# Altium schematic sheet [Acoustics] ADC.SchDoc: Sample Sheet Title
size B; Date: MM/DD/YYYY; Author: Sample Author; Organization: ORGANIZATION; Address1: ADDRESS 1; Address2: ADDRESS 2; Address3: ADDRESS 3; Address4: ADDRESS 4; Revision: -; SheetNumber: 4; SheetTotal: 5; ENG_APP_DATE: --/--/--; DSN_APP_DATE: --/--/--; CHK_APP_DATE: --/--/--
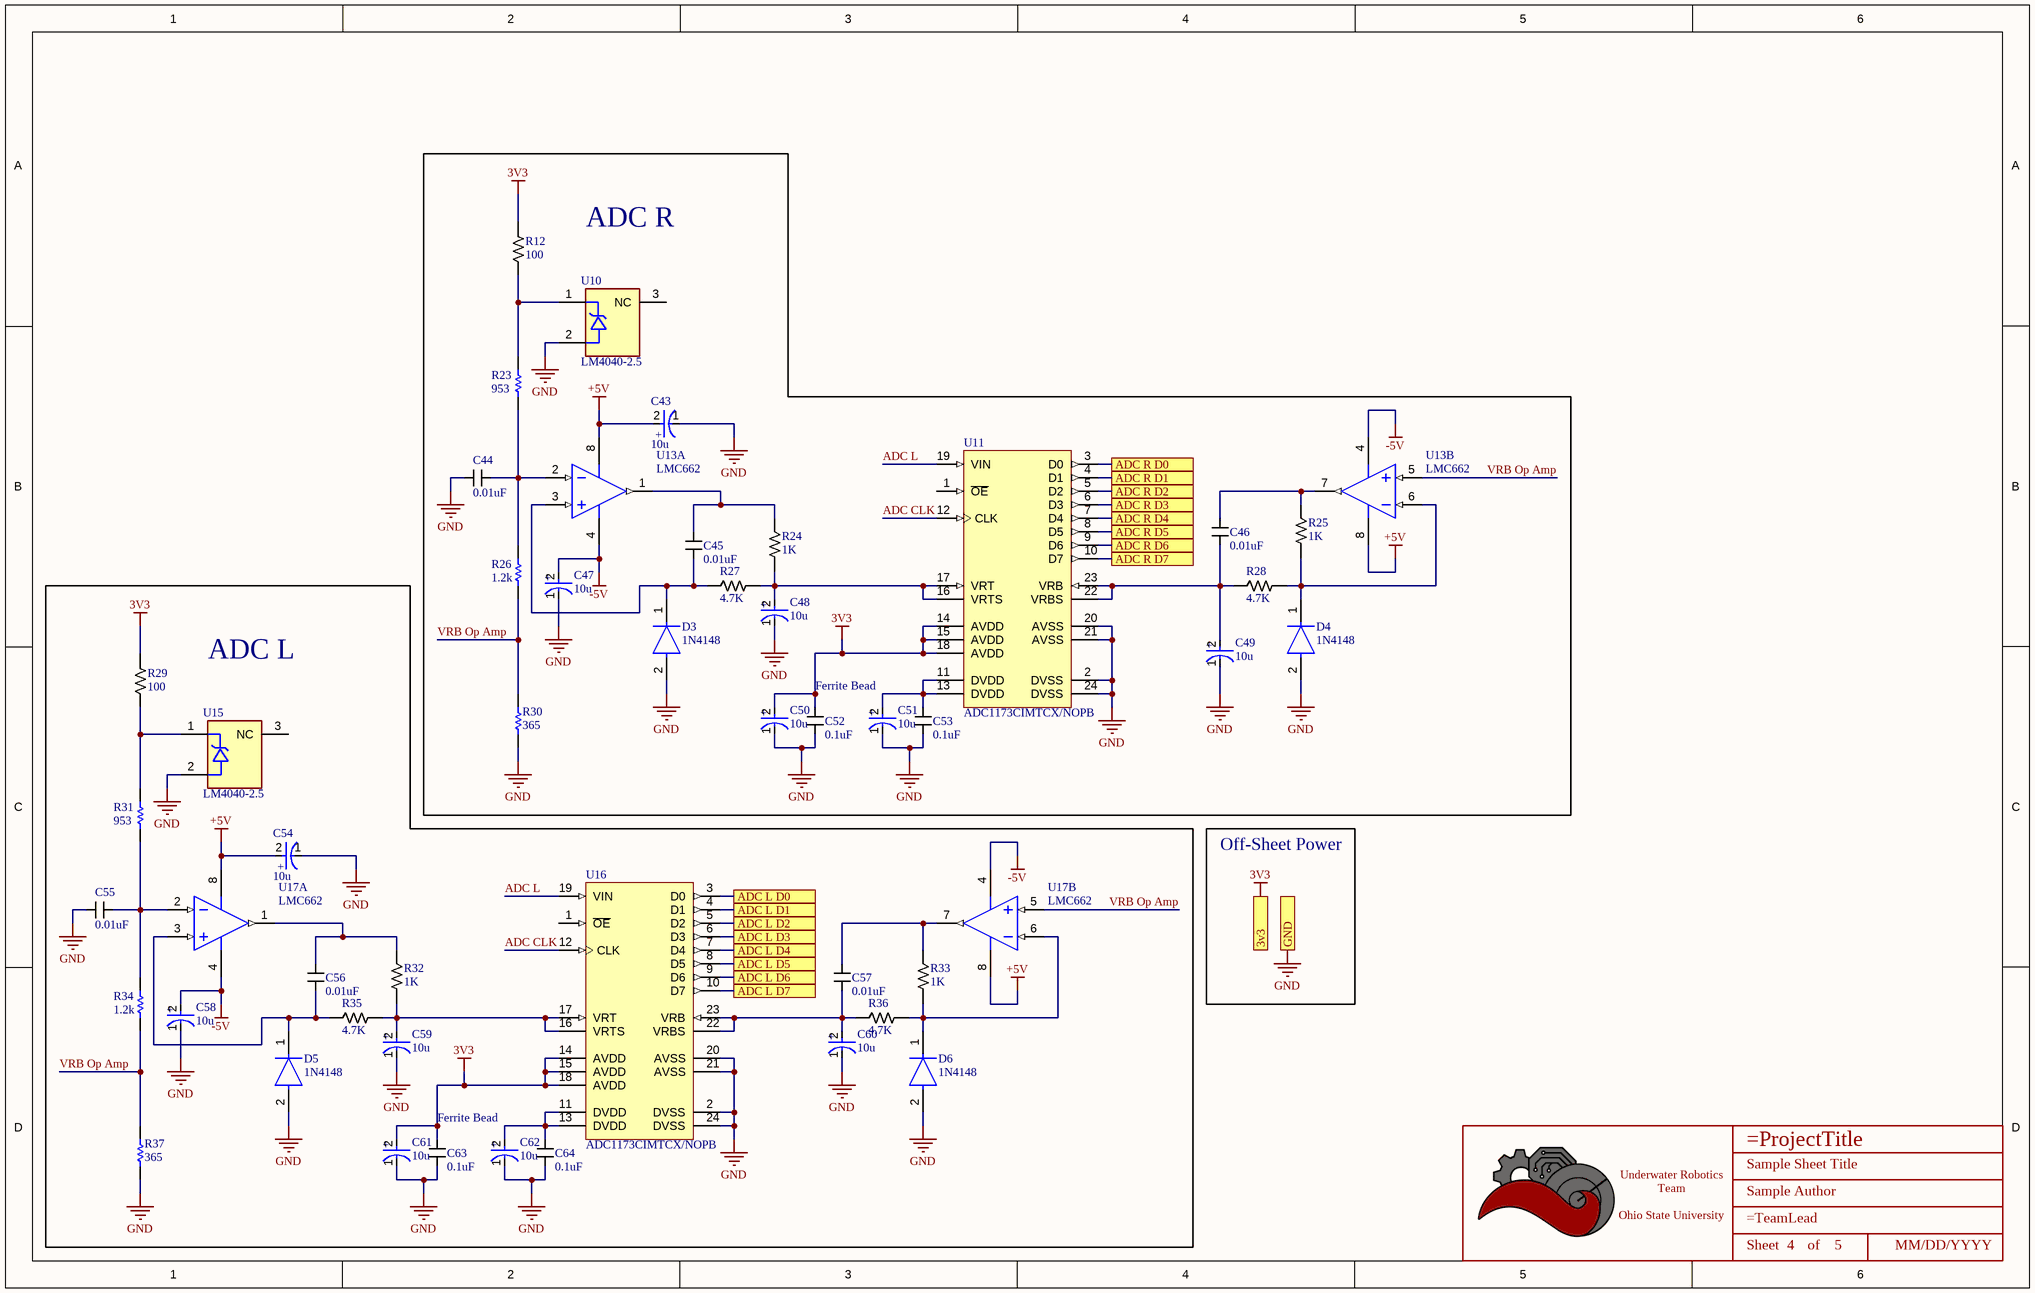
[diagram p0: [Acoustics] ADC.SchDoc]

## Parts
*  Title_Block  [LOGO]  (value not drawn)  (graphical)
C43  10u  [FP-TCJB-MFG]
C44  value 0.01uF  [CAPACITOR_0603]  (hidden comment: CL10B103KB8NNNC)
C45  value 0.01uF  [CAPACITOR_0603]  (hidden comment: CL10B103KB8NNNC)
C46  value 0.01uF  [CAPACITOR_0603]  (hidden comment: CL10B103KB8NNNC)
C47  10u  [FP-TCJB-MFG]
C48  10u  [FP-TCJB-MFG]
C49  10u  [FP-TCJB-MFG]
C50  10u  [FP-TCJB-MFG]
C51  10u  [FP-TCJB-MFG]
C52  value 0.1uF  [CAPACITOR_0603]  (hidden comment: 100nF Ceramic 6.3V)
C53  value 0.1uF  [CAPACITOR_0603]  (hidden comment: 100nF Ceramic 6.3V)
C54  10u  [FP-TCJB-MFG]
C55  value 0.01uF  [CAPACITOR_0603]  (hidden comment: CL10B103KB8NNNC)
C56  value 0.01uF  [CAPACITOR_0603]  (hidden comment: CL10B103KB8NNNC)
C57  value 0.01uF  [CAPACITOR_0603]  (hidden comment: CL10B103KB8NNNC)
C58  10u  [FP-TCJB-MFG]
C59  10u  [FP-TCJB-MFG]
C60  10u  [FP-TCJB-MFG]
C61  10u  [FP-TCJB-MFG]
C62  10u  [FP-TCJB-MFG]
C63  value 0.1uF  [CAPACITOR_0603]  (hidden comment: 100nF Ceramic 6.3V)
C64  value 0.1uF  [CAPACITOR_0603]  (hidden comment: 100nF Ceramic 6.3V)
D3  1N4148  [FP-017AG-MFG]
D4  1N4148  [FP-017AG-MFG]
D5  1N4148  [FP-017AG-MFG]
D6  1N4148  [FP-017AG-MFG]
R12  Value  (Ohms): 100  [RESISTOR_0402]  (hidden comment: 100 Ohm 5% 1/16W)
R23  953  [RESC1005X40X25ML05T05]
R24  Value  (Ohms): 1K  [RESISTOR_0402]  (hidden comment: 1k Ohm 1% 1/16W)
R25  Value  (Ohms): 1K  [RESISTOR_0402]  (hidden comment: 1k Ohm 1% 1/16W)
R26  1.2k  [RESC1005X40X25NL05T10]
R27  Value  (Ohms): 4.7K  [RESISTOR_0402]  (hidden comment: 4.7k Ohm 1% 1/16W)
R28  Value  (Ohms): 4.7K  [RESISTOR_0402]  (hidden comment: 4.7k Ohm 1% 1/16W)
R29  Value  (Ohms): 100  [RESISTOR_0402]  (hidden comment: 100 Ohm 5% 1/16W)
R30  365  [RESC1005X40X25ML05T05]
R31  953  [RESC1005X40X25ML05T05]
R32  Value  (Ohms): 1K  [RESISTOR_0402]  (hidden comment: 1k Ohm 1% 1/16W)
R33  Value  (Ohms): 1K  [RESISTOR_0402]  (hidden comment: 1k Ohm 1% 1/16W)
R34  1.2k  [RESC1005X40X25NL05T10]
R35  Value  (Ohms): 4.7K  [RESISTOR_0402]  (hidden comment: 4.7k Ohm 1% 1/16W)
R36  Value  (Ohms): 4.7K  [RESISTOR_0402]  (hidden comment: 4.7k Ohm 1% 1/16W)
R37  365  [RESC1005X40X25ML05T05]
U10  LM4040-2.5  [FP-SOT23-3LD-PL-1-MFG]
U11  ADC1173CIMTCX/NOPB  [PW0024A_L]
U13  LMC662  [D0008A_L]  (parts A,B of 2)
U15  LM4040-2.5  [FP-SOT23-3LD-PL-1-MFG]
U16  ADC1173CIMTCX/NOPB  [PW0024A_L]
U17  LMC662  [D0008A_L]  (parts A,B of 2)

## Blocks framed on the sheet
ADC R: C43-C53 D3 D4 R12 R23-R28 R30 U10 U11 U13
ADC L: C54-C64 D5 D6 R29 R31-R37 U15-U17

## Ports
3v3, ADC L D0, ADC L D1, ADC L D2, ADC L D3, ADC L D4, ADC L D5, ADC L D6, ADC L D7, ADC R D0, ADC R D1, ADC R D2, ADC R D3, ADC R D4, ADC R D5, ADC R D6, ADC R D7, GND

## Nets
3V3: C50.2(A) C52.1 C61.2(A) C63.1 R12.1 R29.1 U11.14(AVDD) U11.15(AVDD) U11.18(AVDD) U16.14(AVDD) U16.15(AVDD) U16.18(AVDD) ; port 3v3
+5V: C43.2(A) C54.2(A) U13.8(V+) U17.8(V+)
-5V: C47.2(A) C58.2(A) U13.4(V-) U17.4(V-)
GND: C43.1(C) C44.2 C47.1(C) C48.1(C) C49.1(C) C50.1(C) C51.1(C) C52.2 C53.2 C54.1(C) C55.2 C58.1(C) C59.1(C) C60.1(C) C61.1(C) C62.1(C) C63.2 C64.2 D3.2(A) D4.2(A) D5.2(A) D6.2(A) R30.1 R37.1 U10.2(-) U11.2(DVSS) U11.20(AVSS) U11.21(AVSS) U11.24(DVSS) U15.2(-) U16.2(DVSS) U16.20(AVSS) U16.21(AVSS) U16.24(DVSS) ; port GND
ADC CLK: U11.12(CLK) U16.12(CLK)
ADC L: U11.19(VIN) U16.19(VIN)
ADC L D0: U16.3(D0) ; port ADC L D0
ADC L D1: U16.4(D1) ; port ADC L D1
ADC L D2: U16.5(D2) ; port ADC L D2
ADC L D3: U16.6(D3) ; port ADC L D3
ADC L D4: U16.7(D4) ; port ADC L D4
ADC L D5: U16.8(D5) ; port ADC L D5
ADC L D6: U16.9(D6) ; port ADC L D6
ADC L D7: U16.10(D7) ; port ADC L D7
ADC R D0: U11.3(D0) ; port ADC R D0
ADC R D1: U11.4(D1) ; port ADC R D1
ADC R D2: U11.5(D2) ; port ADC R D2
ADC R D3: U11.6(D3) ; port ADC R D3
ADC R D4: U11.7(D4) ; port ADC R D4
ADC R D5: U11.8(D5) ; port ADC R D5
ADC R D6: U11.9(D6) ; port ADC R D6
ADC R D7: U11.10(D7) ; port ADC R D7
VRB Op Amp: R26.1 R30.2 R34.1 R37.2 U13.5(INB+) U17.5(INB+)
NetC44_1: C44.1 R23.1 R26.2 U13.2(INA-)
NetC45_1: C45.1 R24.2 U13.1(OUTA)
NetC45_2: C45.2 D3.1(C) R27.2 U13.3(INA+)
NetC46_1: C46.1 R25.2 U13.7(OUTB)
NetC46_2: C46.2 C49.2(A) R28.2 U11.22(VRBS) U11.23(VRB)
NetC48_2: C48.2(A) R24.1 R27.1 U11.16(VRTS) U11.17(VRT)
NetC51_2: C51.2(A) C53.1 U11.11(DVDD) U11.13(DVDD)
NetC55_1: C55.1 R31.1 R34.2 U17.2(INA-)
NetC56_1: C56.1 R32.2 U17.1(OUTA)
NetC56_2: C56.2 D5.1(C) R35.2 U17.3(INA+)
NetC57_1: C57.1 R33.2 U17.7(OUTB)
NetC57_2: C57.2 C60.2(A) R36.2 U16.22(VRBS) U16.23(VRB)
NetC59_2: C59.2(A) R32.1 R35.1 U16.16(VRTS) U16.17(VRT)
NetC62_2: C62.2(A) C64.1 U16.11(DVDD) U16.13(DVDD)
NetD4_1: D4.1(C) R25.1 R28.1 U13.6(INB-)
NetD6_1: D6.1(C) R33.1 R36.1 U17.6(INB-)
NetR12_2: R12.2 R23.2 U10.1(+)
NetR29_2: R29.2 R31.2 U15.1(+)

Not connected (* = marked no-connect by the designer): U10 3(NC); U11 1(~{OE}); U15 3(NC); U16 1(~{OE})

## Notes on the sheet
- Ferrite Bead
- Off-Sheet Power
- DWG. NO.
- REV.
- SHT.
- THIS DOCUMENT AND THE DATA DISCLOSED HEREIN OR HEREWITH IS THE PROPERTY OF ALTIUM LIMITED AND MAY BE FREELY DISTRIBUTED IN WHOLE. NO RIGHTS ARE RESERVED OR EXPRESS OR IMPLIED WARANTEE GIVEN.
- REVISION
- DESCRIPTION
- DATE
- APPROVED
- ENG:
- APPROVALS
- PROJECT
- DSN:
- CHK:
- REFERENCE DOCUMENTS
- PROJECT REVISION:
- TITLE
- DOCUMENT REVISION:
- DESIGN ITEM:
- BOM:
- FAB DWG:
- PCB DWG:
- ASSY DWG:
- SCALE:
- SIZE
- B
- CAGE CODE
- FILE NAME
- DWG NO.
- SHEET
- OF
- REV
- (in symbol CMP-04423-000142-1) +
- (in symbol Title_Block) Underwater Robotics Team / Ohio State University; Sheet; of

## Library data of the parts
* = Title_Block: UWRT Schematic Title Block Template / Created June 2021, Dylan Trainor
C43 C47-C51 C54 C58-C62 = CMP-04423-000142-1: 10uF 25V  ±20% 90mΩ 1210  SMD Polymer Capacitor
C44-C46 C55-C57 = CAPACITOR_0.01uF_0603_50V: 10000 pF ±10% 50V Ceramic Capacitor X7R 0603 (1608 Metric); Tolerance: +/- 10%; Voltage: 6.3V; Made By: Flip B; ComponentLink1Description: Datsheet; ComponentLink1URL: https://www.mouser.com/datasheet/2/212/KEM_C1002_X7R_SMD-1102033.pdf; Supplier 1: Arrow Electronics; Supplier Part Number 1: CL10B103KB8NNNC
C52 C53 C63 C64 = CAPACITOR_0.1uF_0603: Cap 100nF 6.3V +/-10% / Ceramic 0603; Made By: Flip B; ComponentLink1Description: Datsheet; ComponentLink1URL: https://www.mouser.com/datasheet/2/212/KEM_C1002_X7R_SMD-1102033.pdf; Tolerance: +/- 10%; Voltage: 6.3V; Supplier 1: Digi-Key; Supplier Part Number 1: 399-15351-1-ND
D3-D6 = CMP-07163-000046-1: DIODE GEN PURP 100V 200MA DO35; Forward Voltage: 1V; Max Power Dissipation: 500mW; Max Reverse Current: 5uA; Forward Current: 300mA; Current: 4A; Reverse Recovery Time: 4ns; Element Configuration: Single; Outside Diameter: 1.85mm; Capacitance: 4pF; Polarity: Standard; Max Forward Surge Current (Ifsm): 1A; Reverse Voltage: 100V; Output Current: 200mA; Average Rectified Current: 200mA; Diameter: 1.91mm; Max Repetitive Reverse Voltage (Vrrm): 100V; Current Rating: 200mA; Case/Package: DO-35; Lead Free: Lead Free; Number of Pins: 2; Recovery Time: 4ns; Packaging: Bulk; Contact Plating: Tin; Voltage: 100V; Mount: Through Hole; Max Surge Current: 4A; Package Quantity: 2000; Width: 1.91mm; Max Reverse Voltage (DC): 100V; Length: 4.56mm; Radiation Hardening: No; Power Dissipation: 500mW; Voltage Rating (DC): 100V; Peak Non-Repetitive Surge Current: 4A; REACH SVHC: No SVHC; Height: 4.56mm; Max Operating Temperature: 175°C; Series: -; Weight: 0.01lb; Min Operating Temperature: -65°C
R12 R29 = RESISTOR_100_0402: RES 100 OHM 5% 1/16W 0402; Tolerance: +/- 5%; Made By: Flip B; Wattage: 1/16W; Supplier: Digikey; Digikey Part Numer: 311-100JRTR-ND; Supplier 1: Digi-Key; Supplier Part Number 1: 311-100JRCT-ND
R23 R31 = CMP-1011-00508-2: Part Number: ERJ-2RKF9530X; Manufacturer: Panasonic
R24 R25 R32 R33 = RESISTOR_1K_0402: RES 1k OHM 1% 1/16W 0402; Tolerance: +/- 1%; Made By: Robert Pafford; Wattage: 1/16W; Supplier: Digikey; Digikey Part Numer: CR0603-JW-104ELFTR-ND; Supplier 1: Digi-Key; Supplier Part Number 1: 13-AC0402FR-131KLCT-ND
R26 R34 = CMP-2002-07937-1: Part Number: RC0402JR-071K2L; Manufacturer: Yageo / Phycomp
R27 R28 R35 R36 = RESISTOR_4.7K_0402: RES 4.7k OHM 1% 1/16W 0402; Tolerance: +/- 1%; Made By: Robert Pafford; Wattage: 1/16W; Supplier 1: Digi-Key; Supplier Part Number 1: YAG3497CT-ND
R30 R37 = CMP-1011-00460-2: Part Number: ERJ-2RKF3650X; Manufacturer: Panasonic
U10 U15 = CMP-06323-000002-1: IC VREF SHUNT 2.5V SOT23-3; Manufacturer: Microchip; Manufacturer Part Number: LM4040CYM3-2.5-TR; Nominal Supply Current: 15mA; Standoff Height: 0.013mm; Max Power Dissipation: 306mW; Number Of Outputs: 1; Output Type: Fixed; RoHS: TRUE; Device Class L2: Power Management ICs; ComponentLink2URL: http://ww1.microchip.com/downloads/en/DeviceDoc/LM4040-41-Precision-Micropower-Shunt-Voltage-Reference-DS20005757B.pdf; Lead Free: Yes; Automotive: No; Height: 1.11mm; Ipc Land Pattern Name: SOT95P232X100-3; Ambient Temperature Range Low: -25°C; Device Class L3: Voltage References; Reference Type: Shunt; ComponentLink2Description: Datasheet; Temperature Range Low: -40°C; Package: SOT23-3LD-PL-1; Octopart: https://octopart.com/lm4040cym3-2.5-tr-microchip-66800123; Ambient Temperature Range High: +85°C; Mouser Description: Voltage References Shunt Voltage Reference, 2.5V, 0.5% accuracy, 100ppm/deg (Lead Free); Category: IC; Digikey Description: IC VREF SHUNT 2.5V SOT23-3; Output Voltage: 2.5V; Device Class L1: Integrated Circuits (ICs); Temperature Range High: +85°C; Temperature: -40°C to +85°C
U11 U16 = CMP-0054-00435-3: 8-Bit, 3-Volt, 15MSPS, 33mW A/D Converter, 24-pin TSSOP, Pb-Free; Manufacturer: Texas Instruments; PackageTopMarking: NSUZXYTTE#*ADC1173*CIMTC; PowerWise: N; CompType: ADC IC; ComponentLink1Description: Datasheet URL; PackageReference: PW0024A; PackageDescription: Molded TSSOP, Jedec, 7.8 x 4.4 x 0.9mm Body, 24 Lead, 0.65mm Pitch; PinCount: 24; ComponentLink1URL: http://www.ti.com/general/docs/lit/getliterature.tsp?genericPartNumber=ADC1173&fileType=pdf; Code_JEDEC: MO-153-AD; RoHS: Y
U13 U17 = CMP-0055-00892-3: CMOS Dual Operational Amplifier, 8-pin Narrow SOIC, Pb-Free; Manufacturer: Texas Instruments; PackageTopMarking: NSZXTT*LMC66*2CM; CompType: Amplifiers; PowerWise: N; Code_JEDEC: MS-012-AA; Code_IPC: SOIC127P600-8; Package Reference: D0008A; PinCount: 8; ComponentLink1Description: Datasheet URL; PackageDescription: SOIC Narrow, 4.9 x 3.9 x 1.45mm, 8 Lead, 1.27mm Pitch; RoHS: Y; ComponentLink1URL: http://www.ti.com/general/docs/lit/getliterature.tsp?genericPartNumber=LMC662&fileType=pdf